# EAGLE design Tinybot_v1 (EAGLE 6.5.0)
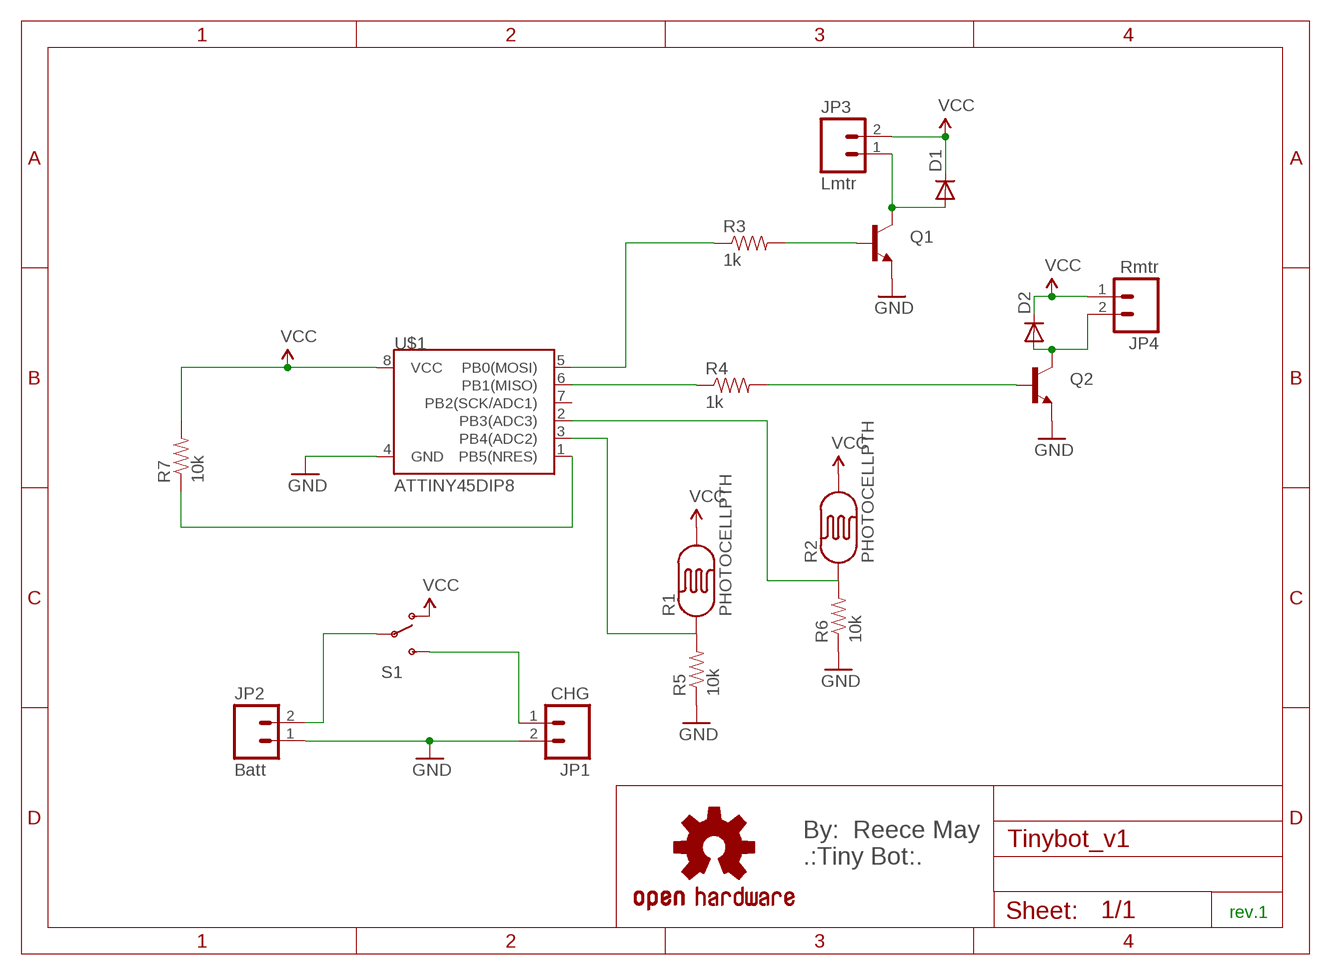
[diagram p0: schematic, sheet 1]

## Parts
D1  DIODESOD  [SOD-323]
D2  DIODESOD  [SOD-323]
JP1  CHG  M02PTH  [1X02]
JP2  Batt  M02PTH  [1X02]
JP3  Lmtr  M02PTH  [1X02]
JP4  Rmtr  M02PTH  [1X02]
Q1  TRANSISTOR_NPNSOT23  [SOT23]
Q2  TRANSISTOR_NPNSOT23  [SOT23]
R1  PHOTOCELLPTH  [PHOTOCELL]
R2  PHOTOCELLPTH  [PHOTOCELL]
R3  1k  RESISTOR0805-RES  [0805]
R4  1k  RESISTOR0805-RES  [0805]
R5  10k  RESISTOR0805-RES  [0805]
R6  10k  RESISTOR0805-RES  [0805]
R7  10k  RESISTOR0805-RES  [0805]
S1  SWITCH-SPST-SMD-A  [SWITCH-SPST-SMD-A]
U$1  ATTINY45DIP8  [DIP08]
U$2  OSHW-LOGOM  [OSHW-LOGO-M]

## Nets
GND: JP1.2 JP2.1 Q1.2(E) Q2.2(E) R5.1 R6.1 U$1.4(GND)
N$1: R3.1 U$1.5(PB0(MOSI))
N$2: R4.1 U$1.6(PB1(MISO))
N$3: Q1.1(B) R3.2
N$4: Q2.1(B) R4.2
N$5: D1.2(A) JP3.1 Q1.3(C)
N$6: D2.2(A) JP4.2 Q2.3(C)
N$8: JP2.2 S1.2(P)
N$11: JP1.1 S1.3(S)
N$12: R2.1 R6.2 U$1.2(PB3(ADC3))
N$13: R1.1 R5.2 U$1.3(PB4(ADC2))
N$14: R7.1 U$1.1(PB5(NRES))
VCC: D1.1(C) D2.1(C) JP3.2 JP4.1 R1.2 R2.2 R7.2 S1.1(O) U$1.8(VCC)
Unconnected: U$1.7(PB2(SCK/ADC1))

## Notes on the sheet
- By:  Reece May
  .:Tiny Bot:.
- rev.1

## Library data of the parts
D1 D2 = SparkFun:DIODE: Diode These are standard reverse protection diodes and small signal diodes. SMA package can handle up to about 1A. SOD-323 can handle about 200mA. What the SOD-323 package when ordering, there are some mfgs out there that are 5-pin packages.
JP1-JP4 = SparkFun:M02: Header 2 Standard 2-pin 0.1" header. Use with straight break away headers (SKU : PRT-00116), right angle break away headers (PRT-00553), swiss pins (PRT-00743), machine pins (PRT-00117), and female headers (PRT-00115). Molex polarized connector foot print use with SKU : PRT-08233 with associated crimp pins and housings.
Q1 Q2 = SparkFun:TRANSISTOR_NPN: Transistor NPN BJT configuration in SOT23 package. MMBT2222 is the common NPN we use. Double check BCE configuration again layout.
R1 R2 = SparkFun:PHOTOCELL: Photocell Also known as a CdS photoresistor. This is a low cost way to detect light levels. Resistance decreases with more incoming light. SparkFun SKU: SEN-09088
R3-R7 = SparkFun:RESISTOR: Resistor Basic schematic elements and footprints for 0603, 1206, and PTH resistors.
S1 = SparkFun:SWITCH-SPST: SPST Switch Simple slide switch. Spark Fun Electronics SKU : COM-00102
U$1 = SparkFun:ATTINY45: Atmel ATTiny45
U$2 = SparkFun:OSHW-LOGO: Open Source Hardware Logo This logo indicates the piece of hardware it is found on incorporates a OSHW license and/or adheres to the definition of open source hardware found here: http://freedomdefined.org/OSHW

## Board
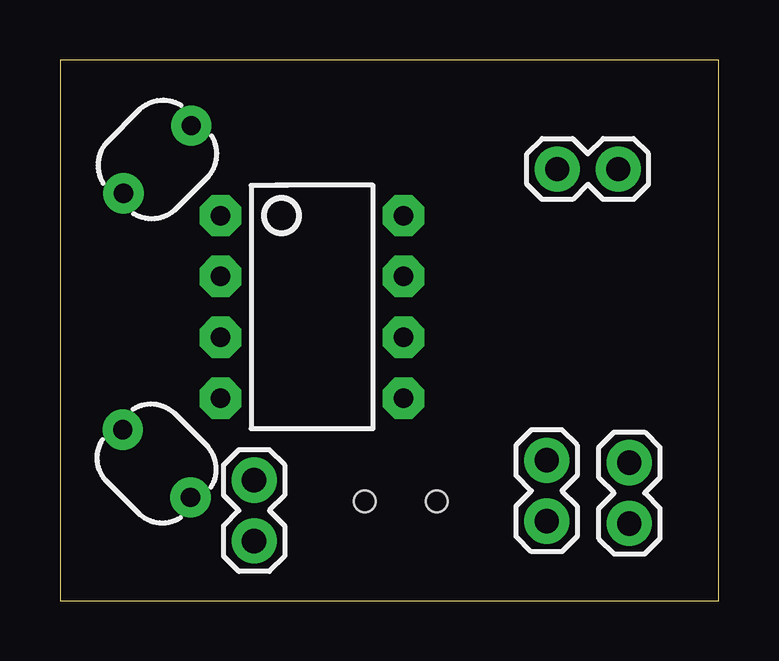
[diagram p1: board, top side]
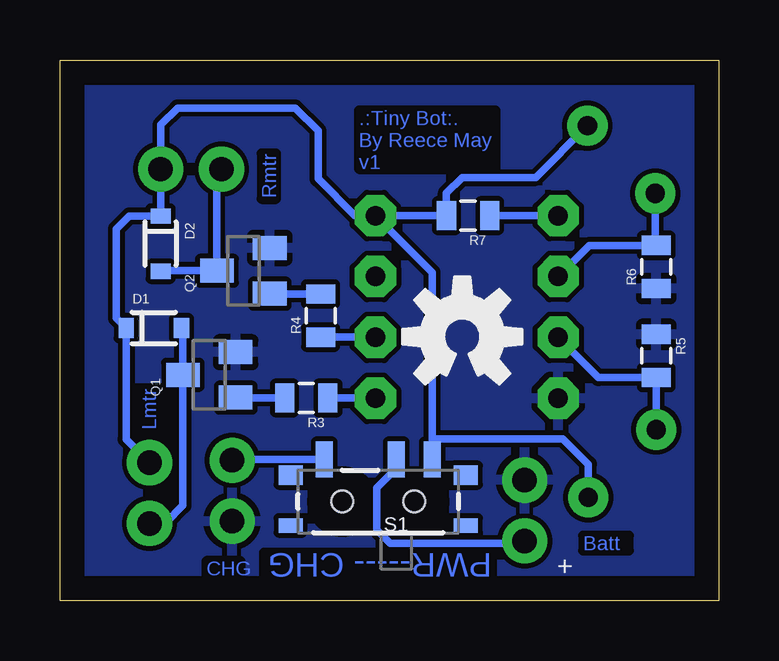
[diagram p2: board, bottom side, seen from below]

Size 27.45 x 22.55 mm. Coordinates in mm from the lower left corner, seen from the top.
Outline: 0,0 27.45,0 27.45,22.55 0,22.55 0,0
Copper layers (1*16): Top 0.035mm / dielectric 1.5mm / Bottom 0.035mm
Design rules "default": minimum track width 10mil, minimum drill 24mil, track to track 8mil, track to pad 8mil, pad to pad 8mil, via to via 8mil, smd to smd 8mil, copper to edge 40mil, drill to drill 8mil, minimum pad ring 10mil, minimum via ring 8mil, stop-mask expansion 4mil, vias tented up to drill 0mil, thermal gap 10mil

### Footprints (pad centres in the part's own frame; a part is rotated, then mirrored left to right if it is on the bottom)
SOD-323 = smd 0.63 x 0.83: 1 -1.15,0; 2 1.15,0
1X02 = drill 1.016 pad 1.88: 1 0,0; 2 2.54,0
SOT23 = smd 1 x 1.4: 1 -0.95,-1.1; 2 0.95,-1.1; 3 0,1.1
PHOTOCELL = drill 0.8 pad 1.676: 1 -2,0; 2 2,0
0805 = smd 0.8 x 1.2: 1 -0.9,0; 2 0.9,0
SWITCH-SPST-SMD-A = smd 0.7 x 1.5: 1 -2.25,-1.75; 2 -0.75,-1.75; 3 2.25,-1.75 | smd 1 x 0.6: GND1 -3.65,1; GND3 3.65,1 | smd 1 x 0.8: GND2 -3.65,-1.1; GND4 3.65,-1.1 | hole 0.9: -1.5,0; 1.5,0
DIP08 = drill 0.813 pad 1.727 octagon: 1 -3.81,-3.81; 2 -1.27,-3.81; 3 1.27,-3.81; 4 3.81,-3.81; 5 3.81,3.81; 6 1.27,3.81; 7 -1.27,3.81; 8 -3.81,3.81

### Placement (x,y rotation side)
D1  23.54,11.37 0 bottom
D2  23.26,14.89 270 bottom
JP1  20.28,5.86 270 top
JP2  8.09,5.03 270 top
JP3  23.72,3.22 90 top
JP4  23.26,18 180 top
Q1  21.23,9.42 90 bottom
Q2  19.81,13.76 90 bottom
R1  4.02,5.72 315 top
R2  4.06,18.4 45 top
R3  17.19,8.46 180 bottom
R4  16.59,11.89 90 bottom
R5  2.61,10.21 270 bottom
R6  2.61,13.92 90 bottom
R7  10.45,16.06 180 bottom
S1  14.19,4.14 180 bottom
U$1  10.5,12.25 270 top
U$2  10.69,11.01 0 bottom

### Tracks (layer width: path | path; a pad name or v marks a point on that pad's centre or on a via)
GND
  pour Bottom: 2.7,22.55 27.3,22.35 27.35,-0.1 -0.05,0 0.05,22.55
N$1
  Bottom 0.305: R3.1 14.33,8.46 U$1.5
N$2
  Bottom 0.305: R4.1 U$1.6
N$3
  Bottom 0.305: R3.2 Q1.1
N$4
  Bottom 0.305: R4.2 18.69,12.79 Q2.1
N$5
  Bottom 0.305: JP3.1 23.69,3.25 23.05,3.25 22.33,3.97 Q1.3 22.33,11.31 D1.2
N$6
  Bottom 0.305: D2.2 23.24,13.76 Q2.3 20.91,17.81 JP4.2
N$8
  Bottom 0.305: S1.2 13.44,5.51 14.25,4.7 14.25,2.95 13.7,2.4 8.18,2.4 JP2.2
N$11
  Bottom 0.305: S1.3 20.25,5.89 JP1.1
N$12
  Bottom 0.305: R6.2 2.65,14.82 | 2.65,14.82 R2.1 | 2.65,14.82 5.39,14.82 U$1.2
N$13
  Bottom 0.305: U$1.3 5.02,9.31 R5.2 R1.1
N$14
  Bottom 0.305: U$1.1 R7.1
VCC
  Bottom 0.305: R2.2 7.64,17.65 10.7,17.65 11.35,17 R7.2 U$1.8 | U$1.8 15.16,16.06 16.7,17.6 16.7,19.6 17.65,20.55 22.55,20.55 23.25,19.85 JP4.1 D2.1 24.56,16.04 25.1,15.5 25.1,11.78 D1.1 24.69,6.73 JP3.2 | S1.1 11.94,6.75 | 11.94,6.75 11.94,13.69 U$1.8 | R1.2 5.44,5.69 6.5,6.75 11.94,6.75

### Text on the board
Bottom: Rmtr | .:Tiny Bot:. / By Reece May / v1 | Lmtr | Batt | PWR----- CHG | CHG
bNames: +